# EAGLE schematic AmmeterBoard-2nd (EAGLE 7.2.0)
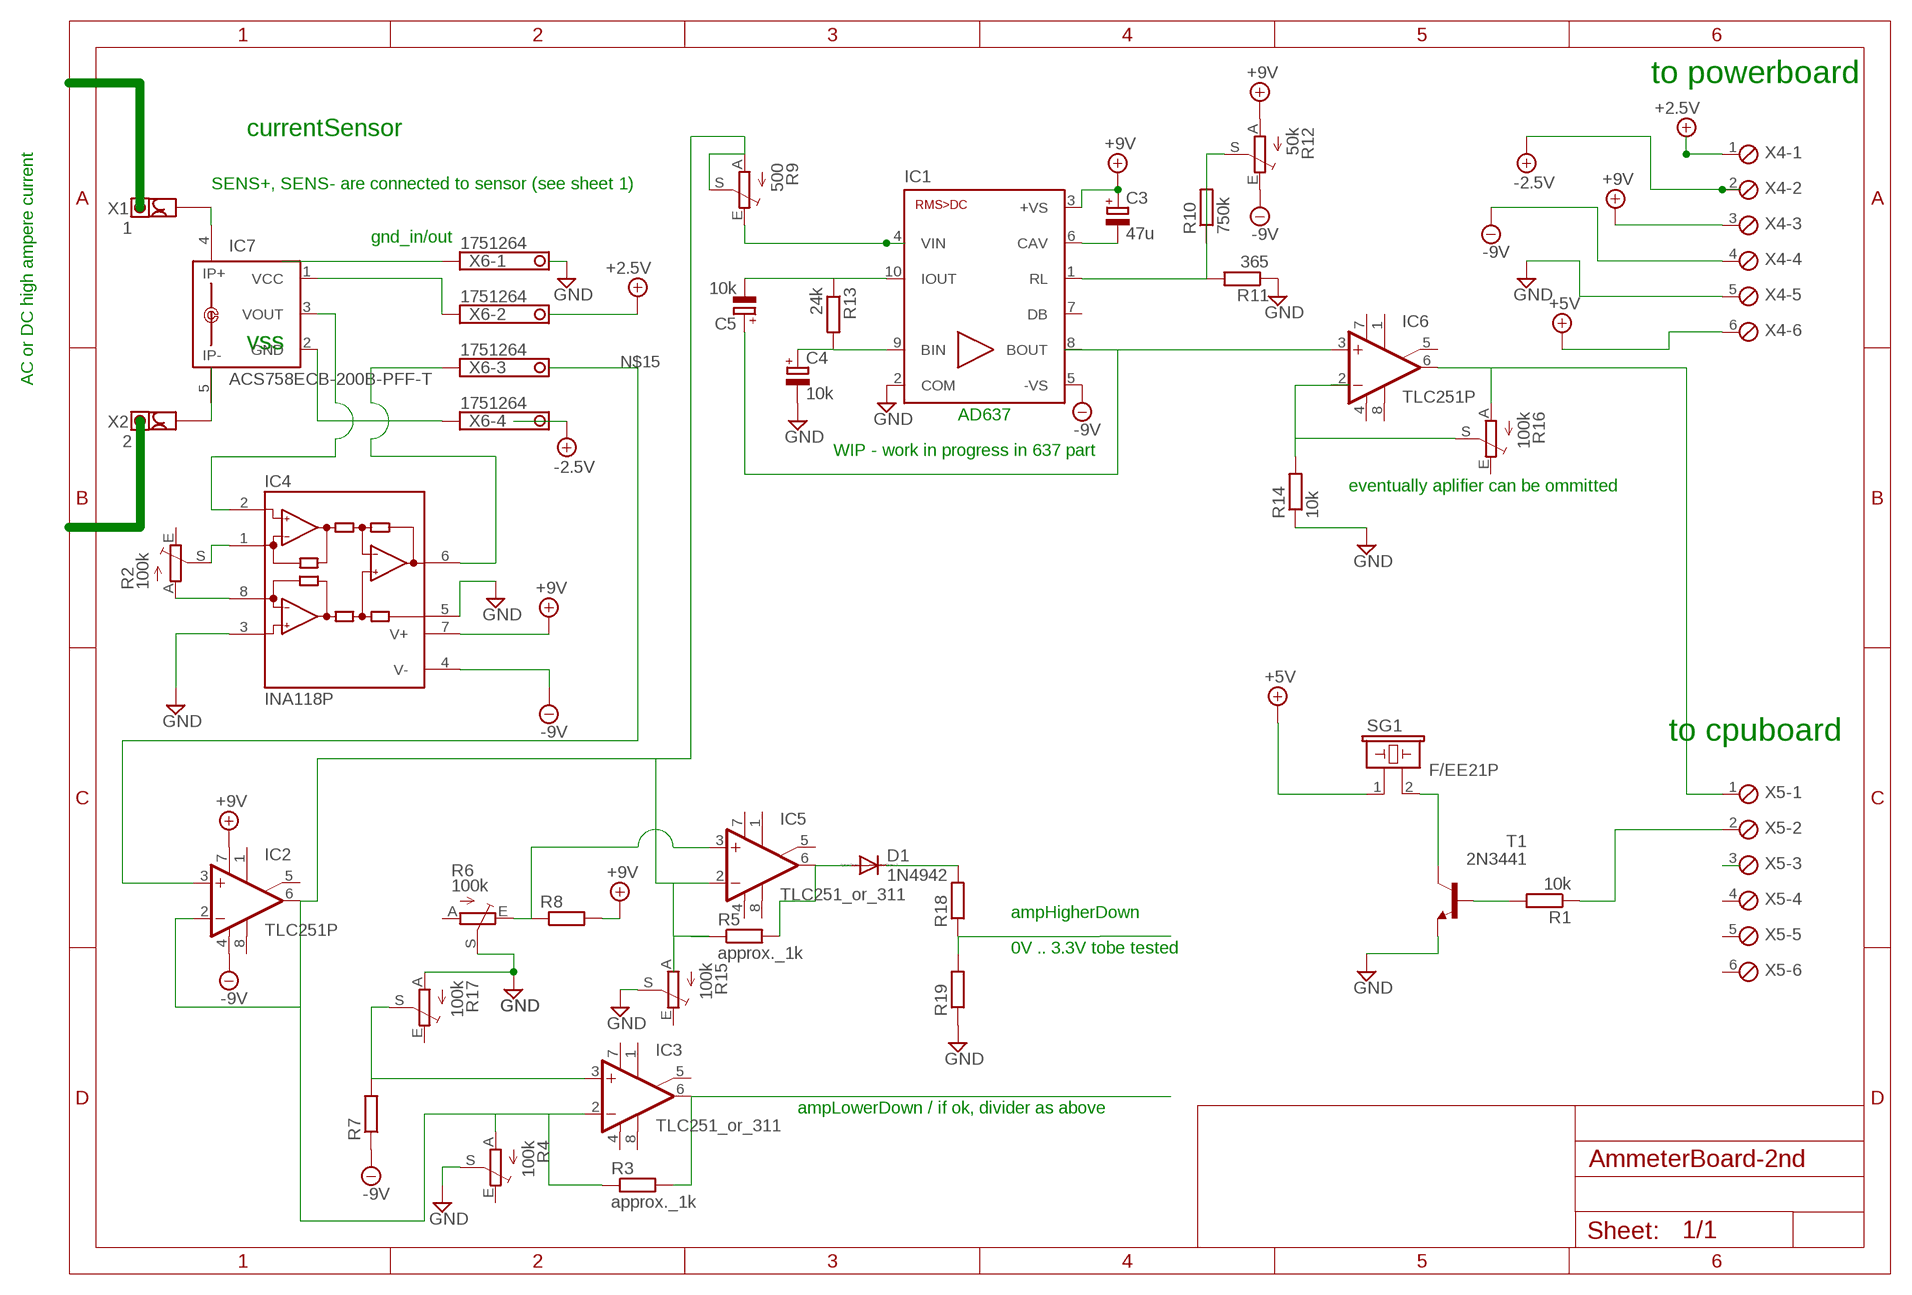
[diagram p0: schematic, sheet 1]

## Parts
C3  47u  CPOL-EUE5-10.5  [E5-10,5]
C4  10k  CPOL-EUE5-10.5  [E5-10,5]
C5  10k  CPOL-EUE5-10.5  [E5-10,5]
D1  1N4942  [DO41-10]
IC1  AD536AJH  [TO100]
IC2  TLC251P  [DIL08]
IC3  TLC251_or_311  TLC251P  [DIL08]
IC4  INA118P  [DIL08]
IC5  TLC251_or_311  TLC251P  [DIL08]
IC6  TLC251P  [DIL08]
IC7  ACS758ECB-200B-PFF-T  [CB-PFF]
R1  10k  R-EU_0207/10  [0207/10]
R2  100k  TRIM_EU-B90P  [SP19L]
R3  approx._1k  R-EU_0207/10  [0207/10]
R4  100k  TRIM_EU-B90P  [SP19L]
R5  approx._1k  R-EU_0207/10  [0207/10]
R6  100k  TRIM_EU-B90P  [SP19L]
R7  R-EU_0207/10  [0207/10]
R8  R-EU_0207/10  [0207/10]
R9  500  TRIM_EU-B90P  [SP19L]
R10  750k  R-EU_0207/10  [0207/10]
R11  365  R-EU_0207/10  [0207/10]
R12  50k  TRIM_EU-B90P  [SP19L]
R13  24k  R-EU_0207/10  [0207/10]
R14  10k  R-EU_0207/10  [0207/10]
R15  100k  TRIM_EU-B90P  [SP19L]
R16  100k  TRIM_EU-B90P  [SP19L]
R17  100k  TRIM_EU-B90P  [SP19L]
R18  R-EU_0207/10  [0207/10]
R19  R-EU_0207/10  [0207/10]
SG1  F/EE21P  [F/EE21P]
T1  2N3441  [TO66]
X1  1  1789650  [1789650]
X2  2  1789650  [1789650]
X4  MPT6  [6POL254]
X5  MPT6  [6POL254]
X6  1751264  [1751264]

## Nets
+4.1V: X4.1 ; supply symbol labelled +2.5V
+5V: SG1.1 X4.6
+9V: C3.+ IC1.3(+VS) IC2.7(V+) IC4.7(V+) R8.2 R12.A X4.3
-4.1V: X4.2 ; supply symbol labelled -2.5V
-9V: IC1.5(-VS) IC2.4(V-) IC4.4(V-) R7.1 R12.E X4.4
GND: C4.- IC1.2(COM) IC4.3(+IN) IC4.5(REF) R4.S R6.S R11.1 R14.1 R15.S R17.A R19.1 T1.1(E) X4.5
N$1: IC4.6(OUT) X6.3
N$3: IC7.2(GND) X6.4
N$4: IC7.1(VCC) X6.2
N$5: IC4.2(-IN) IC7.3(VOUT)
N$6: X6.1
N$7: SG1.2 T1.3(C) T1.TO66(C)
N$8: IC7.4(IP+) X1.B(1B)
N$9: R1.2 T1.2(B)
N$10: R1.1 X5.2
N$11: IC4.8(RG) R2.A
N$12: IC7.5(IP-) X2.B(1B)
N$13: IC4.1(RG) R2.S
N$14: IC2.3(+IN)
N$15: IC2.2(-IN) IC2.6(OUT) IC3.2(-IN) IC5.2(-IN) R3.1 R4.A R9.A R9.S R15.A
N$16: IC5.3(+IN) R6.E R8.1
N$17: R5.1
N$18: IC1.4(VIN) R9.E
N$19: IC1.1(RL) R10.1 R10.2 R11.2 R12.S
N$20: C5.- IC1.10(IOUT) R13.1
N$21: C3.- IC1.6(CAV)
N$22: C4.+ IC1.9(BIN) R13.2
N$23: C5.+
N$24: IC3.3(+IN) R7.2 R17.S
N$25: IC6.3(+IN)
N$26: IC6.6(OUT) R16.A X5.1
N$27: IC6.2(-IN) R14.2 R16.S
N$28: D1.A IC5.6(OUT) R5.2
N$29: D1.C R18.2
N$30: R18.1 R19.2
N$31: X5.3
N$32: IC3.6(OUT) R3.2
Unconnected: IC1.7(DB) IC1.8(BOUT) IC2.1(ON1) IC2.5(ON2) IC2.8(OPT) IC3.1(ON1) IC3.5(ON2) IC3.8(OPT) IC5.1(ON1) IC5.5(ON2) IC5.8(OPT) IC6.1(ON1) IC6.5(ON2) IC6.8(OPT) IC7.IP+1 IC7.IP-1 R2.E R4.E R6.A R15.E R16.E R17.E X1.A(1A) X2.A(1A) X5.4 X5.5 X5.6

## Notes on the sheet
- to powerboard
- currentSensor
- SENS+, SENS- are connected to sensor (see sheet 1)
- gnd_in/out
- vss
- AC or DC high ampere current
- AD637
- WIP - work in progress in 637 part
- eventually aplifier can be ommitted
- to cpuboard
- ampHigherDown
- 0V .. 3.3V tobe tested
- ampLowerDown / if ok, divider as above

## Power pins joined to a net without a drawn wire
V+: IC3.7(V+) IC5.7(V+) IC6.7(V+)
V-: IC3.4(V-) IC5.4(V-) IC6.4(V-)

## Library data of the parts
C3-C5 = resistor:CPOL-EU: POLARIZED CAPACITOR, European symbol
D1 = diode:1N4942: DIODE 1.0 A, 200 V, 150 ns
IC1 = analog-devices:AD536AJH: ANALOG DEVICES
IC2 IC3 IC5 IC6 = linear:TLC251: OP AMP
IC4 = burr-brown:INA118: Instrumentation Amplifier Precision, Low Power; MF: TEXAS INSTRUMENTS; MPN: INA118P; OC_FARNELL: 1470354; OC_NEWARK: 96K4515
IC7 = allegro:ACS758*: Thermally Enhanced, Fully Integrated, Hall Effect-Based Linear Current Sensor with 100 micro Ohm Current Conductor display layer 49 Reference in BRD and place VIAs on circles Source: http://www.allegromicro.com/en/Products/Part_Numbers/0758/0758.pdf
R1 R3 R5 R7 R8 R10 R11 R13 R14 R18 R19 = resistor:R-EU_: RESISTOR, European symbol
R2 R4 R6 R9 R12 R15-R17 = pot:TRIM_EU-: POTENTIOMETER
SG1 = buzzer:F/EE21P: BUZZER Source: Buerklin; OC_FARNELL: unknown; OC_NEWARK: unknown
T1 = transistor:2N3441: NPN TRANSISTOR
X1 X2 = con-phoenix-3.81:1789650: FFKDS/H-3,81 Printklemme Nennstrom: 12 A Bemessungsspannung: 160 V Raster: 3,81 mm Polzahl: 1 Montageart: Löten Anschlussart:Federkraftanschluss Anschlussrichtung vom Leiter zur Platine: 0° Source: 1789650.pdf
X4 X5 = con-phoenix-254:MPT6: PHOENIX CONNECTOR
X6 = con-phoenix-350:1751264: MKDS 1/ 4-3,5 Printklemme Nennstrom: 10 A Bemessungsspannung: 160 V Raster: 3,5 mm Polzahl: 4 Montageart: Löten Anschlussart: Schraubanschluss Anschlussrichtung vom Leiter zur Platine: 0° Source: http://eshop.phoenixcontact.com .. 1751264.pdf